# EAGLE design Swbot_shield (EAGLE 6.3)
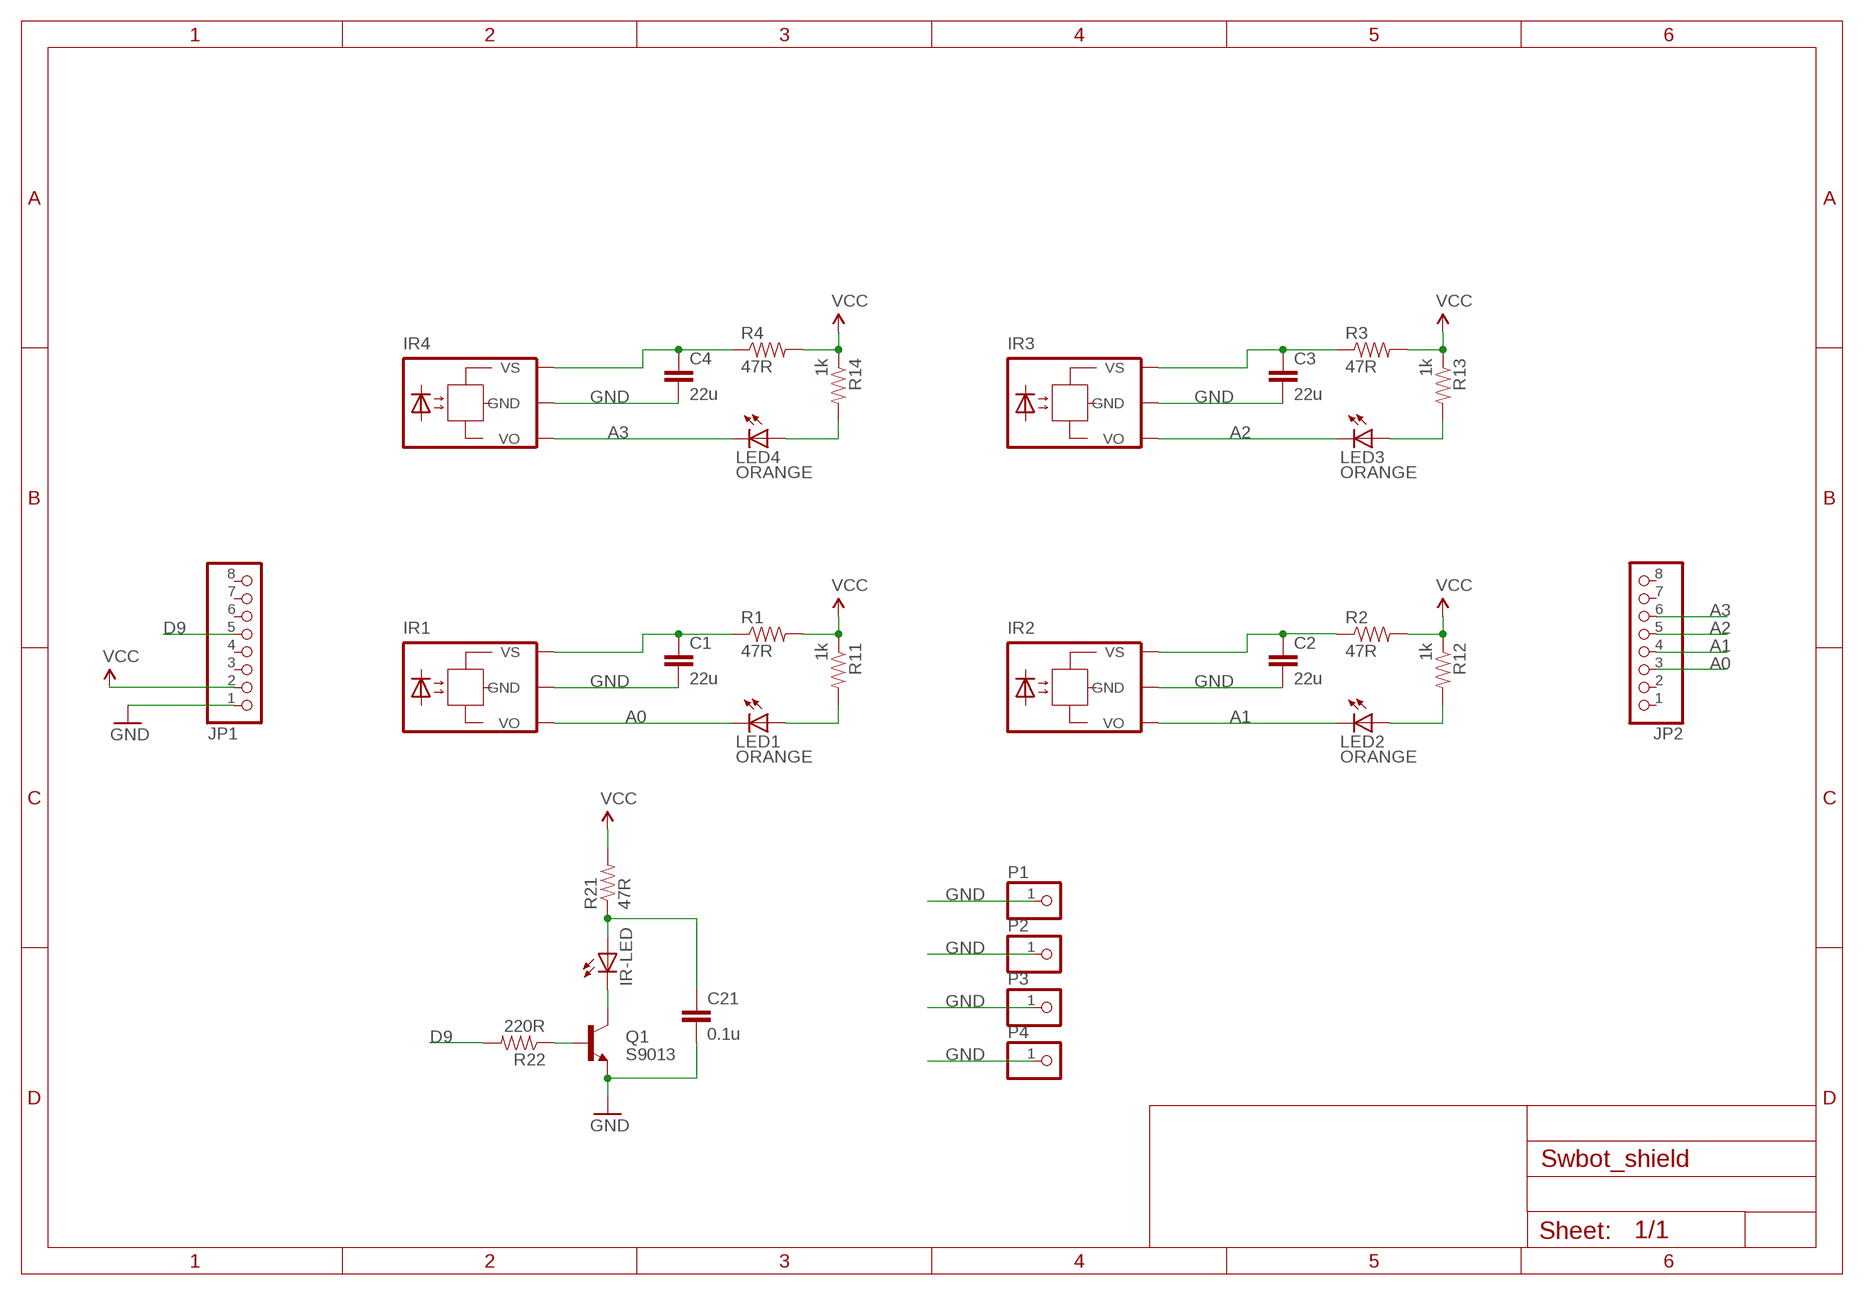
[diagram p0: schematic, sheet 1]

## Parts
C1  22u  CAP1206  [1206]
C2  22u  CAP1206  [1206]
C3  22u  CAP1206  [1206]
C4  22u  CAP1206  [1206]
C21  0.1u  CAP0805  [0805]
IR1  -NJL  [TSOP]
IR2  -NJL  [TSOP]
IR3  -NJL  [TSOP]
IR4  -NJL  [TSOP]
IR-LED  LED5MM  [LED5MM]
JP1  PINHD-1X8  [1X08]
JP2  PINHD-1X8  [1X08]
LED1  ORANGE  LEDCHIPLED_0805  [CHIPLED_0805]
LED2  ORANGE  LEDCHIPLED_0805  [CHIPLED_0805]
LED3  ORANGE  LEDCHIPLED_0805  [CHIPLED_0805]
LED4  ORANGE  LEDCHIPLED_0805  [CHIPLED_0805]
P1  PINHD-1X1  [1X01]
P2  PINHD-1X1  [1X01]
P3  PINHD-1X1  [1X01]
P4  PINHD-1X1  [1X01]
Q1  S9013  TRANSISTOR_NPNSOT23-3  [SOT23-3]
R1  47R  RESISTOR0805-RES  [0805]
R2  47R  RESISTOR0805-RES  [0805]
R3  47R  RESISTOR0805-RES  [0805]
R4  47R  RESISTOR0805-RES  [0805]
R11  1k  RESISTOR0805-RES  [0805]
R12  1k  RESISTOR0805-RES  [0805]
R13  1k  RESISTOR0805-RES  [0805]
R14  1k  RESISTOR0805-RES  [0805]
R21  47R  RESISTOR0805-RES  [0805]
R22  220R  RESISTOR0805-RES  [0805]

## Nets
A0: IR1.VO JP2.3 LED1.C
A1: IR2.VO JP2.4 LED2.C
A2: IR3.VO JP2.5 LED3.C
A3: IR4.VO JP2.6 LED4.C
D9: JP1.5 R22.2
GND [vcc]: C1.2 C2.2 C3.2 C4.2 C21.2 IR1.GND IR2.GND IR3.GND IR4.GND JP1.1 P1.1 P2.1 P3.1 P4.1 Q1.2(E)
N$1: LED1.A R11.2
N$2: C21.1 IR-LED.A R21.1
N$3: IR-LED.K(C) Q1.3(C)
N$4: LED2.A R12.2
N$5: Q1.1(B) R22.1
N$6: LED3.A R13.2
N$7: C2.1 IR2.VCC(VS) R2.1
N$8: LED4.A R14.2
N$9: C4.1 IR4.VCC(VS) R4.1
N$10: C3.1 IR3.VCC(VS) R3.1
N$11: C1.1 IR1.VCC(VS) R1.1
VCC [vcc]: JP1.2 R1.2 R2.2 R3.2 R4.2 R11.1 R12.1 R13.1 R14.1 R21.2
Unconnected: JP1.3 JP1.4 JP1.6 JP1.7 JP1.8 JP2.1 JP2.2 JP2.7 JP2.8

## Library data of the parts
C1-C4 C21 = SparkFun-Passives:CAP: Capacitor Standard 0603 ceramic capacitor, and 0.1" leaded capacitor.
IR1-IR4 = LeoBuild:?-NJL*
IR-LED = SparkFun-LED:LED: LEDs Standard schematic elements and footprints for 5mm, 3mm, 1206, and 0603 sized LEDs. 5mm - Spark Fun Electronics SKU : COM-00529 (and others)
JP1 JP2 = pinhead:PINHD-1X8: PIN HEADER
LED1-LED4 = led:LED: LED OSRAM: - CHIPLED LG R971, LG N971, LY N971, LG Q971, LY Q971, LO R971, LY R971 LH N974, LH R974 LS Q976, LO Q976, LY Q976 LO Q996 - Hyper CHIPLED LW Q18S LB Q993, LB Q99A, LB R99A - SideLED LS A670, LO A670, LY A670, LG A670, LP A670 LB A673, LV A673, LT A673, LW A673 LH A674 LY A675 LS A676, LA A676, LO A676, LY A676, LW A676 LS A679, LY A679, LG A679 - Hyper Micro SIDELED® LS Y876, LA Y876, LO Y876, LY Y876 LT Y87S - SmartLED LW L88C, LW L88S LB L89C, LB L89S, LG L890 LS L89K, LO L89K, LY L89K LS L896, LA L896, LO L896, LY L896 - TOPLED LS T670, LO T670, LY T670, LG T670, LP T670 LSG T670, LSP T670, LSY T670, LOP T670, LYG T670 LG T671, LOG T671, LSG T671 LB T673, LV T673, LT T673, LW T673 LH T674 LS T676, LA T676, LO T676, LY T676, LB T676, LH T676, LSB T676, LW T676 LB T67C, LV T67C, LT T67C, LS T67K, LO T67K, LY T67K, LW E67C LS E67B, LA E67B, LO E67B, LY E67B, LB E67C, LV E67C, LT E67C LW T67C LS T679, LY T679, LG T679 LS T770, LO T770, LY T770, LG T770, LP T770 LB T773, LV T773, LT T773, LW T773 LH T774 LS E675, LA E675, LY E675, LS T675 LS T776, LA T776, LO T776, LY T776, LB T776 LHGB T686 LT T68C, LB T68C - Hyper Mini TOPLED® LB M676 - Mini TOPLED Santana® LG M470 LS M47K, LO M47K, LY M47K Source: http://www.osram.convergy.de LUXEON: - LUMILED® LXK2-PW12-R00, LXK2-PW12-S00, LXK2-PW14-U00, LXK2-PW14-V00 LXK2-PM12-R00, LXK2-PM12-S00, LXK2-PM14-U00 LXK2-PE12-Q00, LXK2-PE12-R00, LXK2-PE12-S00, LXK2-PE14-T00, LXK2-PE14-U00 LXK2-PB12-K00, LXK2-PB12-L00, LXK2-PB12-M00, LXK2-PB14-N00, LXK2-PB14-P00, LXK2-PB14-Q00 LXK2-PR12-L00, LXK2-PR12-M00, LXK2-PR14-Q00, LXK2-PR14-R00 LXK2-PD12-Q00, LXK2-PD12-R00, LXK2-PD12-S00 LXK2-PH12-R00, LXK2-PH12-S00 LXK2-PL12-P00, LXK2-PL12-Q00, LXK2-PL12-R00 Source: www.luxeon.com KINGBRIGHT: KA-3528ASYC Source: www.kingbright.com
P1-P4 = pinhead:PINHD-1X1: PIN HEADER
Q1 = SparkFun-DiscreteSemi:TRANSISTOR_NPN: Generic NPN BJT. MMBT2222 is the common NPN we use. Double check against datasheet- not all devices are the same!
R1-R4 R11-R14 R21 R22 = SparkFun-Resistors:RESISTOR: Resistor Basic schematic elements and footprints for 0603, 1206, and PTH resistors.

## Net classes
0 default: width 0.254 mm
1 vcc: width 0.406 mm

## Board
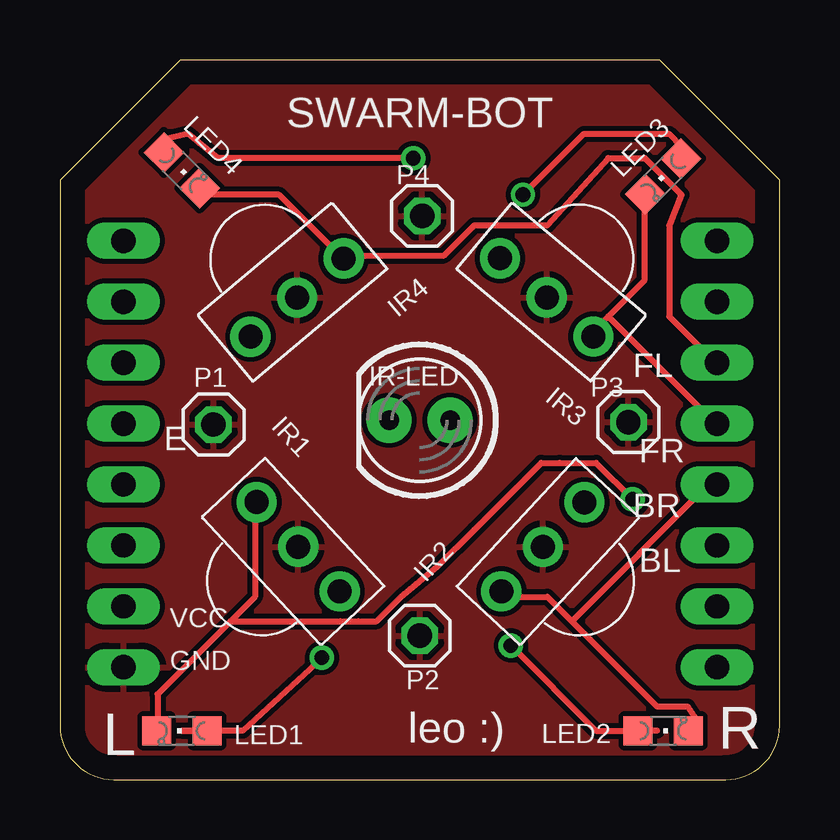
[diagram p1: board, top side]
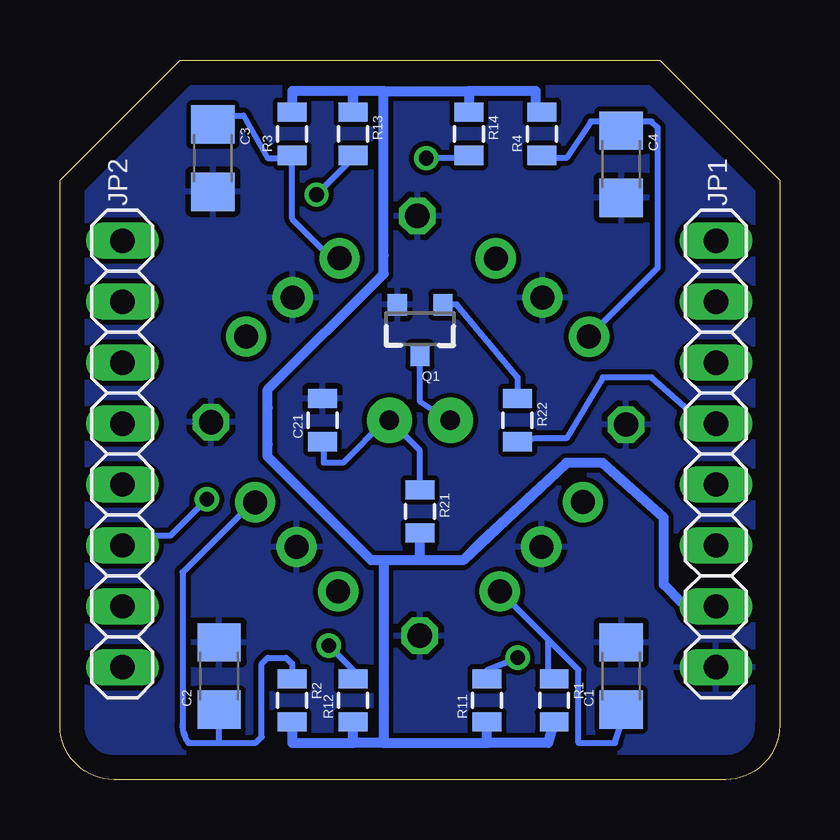
[diagram p2: board, bottom side, seen from below]

Size 30 x 30 mm. Coordinates in mm from the lower left corner, seen from the top.
Outline: 0,25 0,2.24 arc90 2.24,0 27.76,0 arc90 30,2.24 30,25 25,30 5,30 0,25
Copper layers (1*16): Top 0.035mm / dielectric 1.5mm / Bottom 0.035mm
Design rules "default": minimum track width 10mil, minimum drill 24mil, track to track 8mil, track to pad 8mil, pad to pad 8mil, via to via 8mil, smd to smd 8mil, copper to edge 40mil, drill to drill 8mil, minimum pad ring 10mil, minimum via ring 8mil, stop-mask expansion 4mil, vias tented up to drill 0mil, thermal gap 10mil

### Footprints (pad centres in the part's own frame; a part is rotated, then mirrored left to right if it is on the bottom)
1206 = smd 1.6 x 1.8: 1 -1.4,0; 2 1.4,0
0805 = smd 0.8 x 1.2: 1 -0.9,0; 2 0.9,0
TSOP = drill 1 pad 1.676: GND 0,2.54; VCC 2.54,2.54; VO -2.54,2.54
LED5MM = drill 0.813 pad 1.88: A -1.27,0; K 1.27,0
1X08 = drill 1.016 long: 1 -8.89,0; 2 -6.35,0; 3 -3.81,0; 4 -1.27,0; 5 1.27,0; 6 3.81,0; 7 6.35,0; 8 8.89,0
CHIPLED_0805 = smd 1.2 x 1.2: A 0,-1.05; C 0,1.05
1X01 = drill 1.016 octagon: 1 0,0
SOT23-3 = smd 0.8 x 0.9: 1 -0.95,-1; 2 0.95,-1; 3 0,1.1

### Placement (x,y rotation side)
C1  6.6,4.32 90 bottom
C2  23.37,4.32 90 bottom
C3  23.62,25.91 270 bottom
C4  6.6,25.65 270 bottom
C21  19.05,14.99 90 bottom
IR1  8.08,7.97 313 top
IR2  21.99,7.97 47 top
IR3  21.93,22.05 140 top
IR4  8.25,22.04 220 top
IR-LED  14.99,14.98 180 top
JP1  2.65,13.57 90 bottom
JP2  27.4,13.57 90 bottom
LED1  5.08,2.03 90 top
LED2  25.15,2.03 270 top
LED3  25.15,25.15 135 top
LED4  5.08,25.4 225 top
P1  6.4,14.8 0 top
P2  15,6 0 top
P3  23.7,14.9 0 top
P4  15.1,23.5 0 top
Q1  14.99,18.8 180 bottom
R1  9.4,3.3 270 bottom
R2  20.32,3.3 270 bottom
R3  20.32,26.92 90 bottom
R4  9.91,26.92 90 bottom
R11  12.19,3.3 90 bottom
R12  17.78,3.3 90 bottom
R13  17.78,26.92 270 bottom
R14  12.95,26.92 270 bottom
R21  14.99,11.18 270 bottom
R22  10.92,14.99 270 bottom

### Tracks (layer width: path | path; a pad name or v marks a point on that pad's centre or on a via)
A0  (via drill 0.61)
  Top 0.254: 7.11,6.6 8.13,7.62 8.13,11.18 IR1.VO | 7.11,6.6 4.06,3.56 4.06,2.03 LED1.C | v23.88,11.68 22.35,13.21 20.83,13.21 20.07,13.21 17.27,10.41 15.75,8.89 14.22,7.62 13.21,6.6 12.45,6.6 11.68,6.6 7.11,6.6
  Bottom 0.254: v23.88,11.68 25.4,10.16 26.92,10.16 JP2.3
A1
  Top 0.254: 21.34,6.6 20.32,7.62 18.8,7.62 IR2.VO | 21.34,6.6 24.89,3.05 26.16,3.05 26.67,2.29 26.2,2.25 LED2.C | 21.34,6.6 26.92,12.19 JP2.4
A2
  Top 0.254: 22.86,19.3 22.35,18.8 IR3.VO | 22.86,19.3 24.38,20.83 24.38,24.38 LED3.C | 22.86,19.3 26.92,15.24 JP2.5
A3
  Top 0.254: LED4.C 6.1,24.38 9.14,24.38 11.68,21.84 IR4.VO 12.19,21.84 16,21.84 17.27,23.11 20.32,23.11 22.86,25.91 24.38,25.91 25.91,24.38 25.4,23.11 25.4,19.3 26.92,17.78 JP2.6
D9
  Bottom 0.254: R22.2 10.16,14.22 8.89,14.22 7.37,16.76 5.33,16.76 3.05,14.73 JP1.5
GND
  pour Bottom: 0,30 30,30 30,0 0,0
  pour Top: 0,0 30,0 30,30 0,30
N$1  (via drill 0.61)
  Top 0.254: LED1.A 5.08,2.03 7.62,2.03 v10.92,5.08
  Bottom 0.254: v10.92,5.08 12.19,4.57 R11.2
N$2
  Bottom 0.254: R21.1 15,13 15,13.72 IR-LED.A 16.42,14.98 18.2,13.2 19,13.2 19,14.04 C21.1
N$3
  Bottom 0.254: Q1.3 14.99,17.27 14.99,15.75 14.22,15.24 IR-LED.K
N$4  (via drill 0.61)
  Top 0.254: 24.89,2.03 LED2.A 23.88,2.03 22.35,2.03 v18.8,5.59
  Bottom 0.254: v18.8,5.59 17.78,4.57 R12.2
N$5
  Bottom 0.254: Q1.1 13.72,19.81 13.46,19.81 10.92,16.76 R22.1
N$6  (via drill 0.61)
  Top 0.254: 25.91,26.42 LED3.A 25.91,26.42 | 25.91,26.42 25.4,26.92 25.15,26.92 21.84,26.92 v19.3,24.38
  Bottom 0.254: v19.3,24.38 17.78,25.91 R13.2
N$7
  Bottom 0.254: 23.37,1.52 21.84,1.52 21.59,1.78 21.59,4.83 21.34,5.08 20.57,5.08 20.32,4.83 R2.1 | 23.37,1.52 C2.1 23.37,1.52 | 23.37,1.52 24.64,1.52 arc37 24.89,2.29 24.89,8.64 22.35,11.18 IR2.VCC
N$8  (via drill 0.61)
  Top 0.254: 4.32,26.67 LED4.A 4.32,26.67 | v14.73,25.91 6.6,25.91 5.33,26.92 4.32,26.67
  Bottom 0.254: v14.73,25.91 13.21,25.91 R14.2
N$9
  Bottom 0.254: 6.6,27.43 7.87,27.43 8.89,25.91 9.4,25.91 R4.1 | 6.6,27.43 C4.1 6.6,27.43 | 6.6,27.43 5.33,27.43 5.08,27.18 5.08,21.34 7.62,18.8 IR4.VCC
N$10
  Bottom 0.254: C3.1 23.62,27.69 23.11,27.69 22.35,27.69 21.34,25.91 20.57,25.91 R3.1 20.32,25.91 20.32,23.37 18.8,21.84 IR3.VCC
N$11
  Bottom 0.254: 9.65,5.84 8.38,4.57 8.38,1.52 6.86,1.52 6.48,2.66 C1.1 | 9.65,5.84 9.65,4.57 | 9.65,4.57 R1.1 9.65,4.57 | 9.65,5.84 9.65,4.57 | 9.65,5.84 11.18,7.37 IR1.VCC
VCC
  Bottom 0.406: JP1.2 4.06,7.37 4.83,8.13 4.83,10.92 7.37,13.21 8.89,13.21 | 8.89,13.21 12.45,9.91 13.21,9.14 | 13.21,9.14 14.99,9.14 R21.2 | 13.21,9.14 16.51,9.14 | 16.51,9.14 16.51,2.29 | 16.51,2.29 16.51,1.52 | 16.51,1.52 12.19,1.52 | 12.19,1.52 R11.1 | R1.2 9.65,1.52 12.19,1.52 | 16.51,2.29 16.51,1.52 | 16.51,1.52 17.78,1.52 | 17.78,1.52 R12.1 | R2.2 20.32,1.52 17.78,1.52 | 8.89,13.21 13.21,9.14 | 13.21,9.14 16.51,9.14 | 16.51,9.14 17.02,9.14 21.34,13.46 21.34,13.97 21.34,15.49 21.34,16.26 16.51,21.08 16.51,21.84 16.51,28.7 | 16.51,28.7 17.78,28.7 | 17.78,28.7 R13.1 17.78,28.7 | 17.78,28.7 20.32,28.7 R3.2 | 16.51,28.7 12.95,28.7 | 12.95,28.7 R14.1 | R4.2 10.16,28.08 10.16,28.7 12.95,28.7

### Text on the board
tPlace: SWARM-BOT | FL | E | FR | BR | BL | VCC | GND | leo :) | L | R